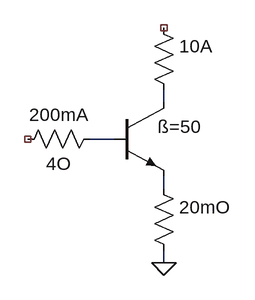
[diagram p0: schematic 2.asc]
2.asc, the LTspice schematic file:
Version 4
SHEET 1 880 680
WIRE 224 112 224 96
WIRE 160 160 128 160
WIRE 224 224 224 208
WIRE 224 320 224 304
FLAG 224 320 0
SYMBOL npn 160 112 R0
SYMATTR InstName ß=50
SYMATTR Value ""
SYMBOL res 208 0 R0
SYMATTR InstName 10A
SYMATTR Value ""
SYMBOL res 208 208 R0
SYMATTR InstName 20mO
SYMATTR Value ""
SYMBOL res 32 176 R270
WINDOW 0 32 56 VTop 2
WINDOW 3 0 56 VBottom 2
SYMATTR InstName 200mA
SYMATTR Value 4O

The netlist it stands for:
* 2.asc
Q§ß=50 N001 N002 N003 0
R§10A NC_01 N001
R§20mO N003 0
R§200mA NC_02 N002 4O
.model NPN NPN
.model PNP PNP
.lib standard.bjt
.backanno
.end